# EAGLE design CANBUS_USB (EAGLE 9.6.2)
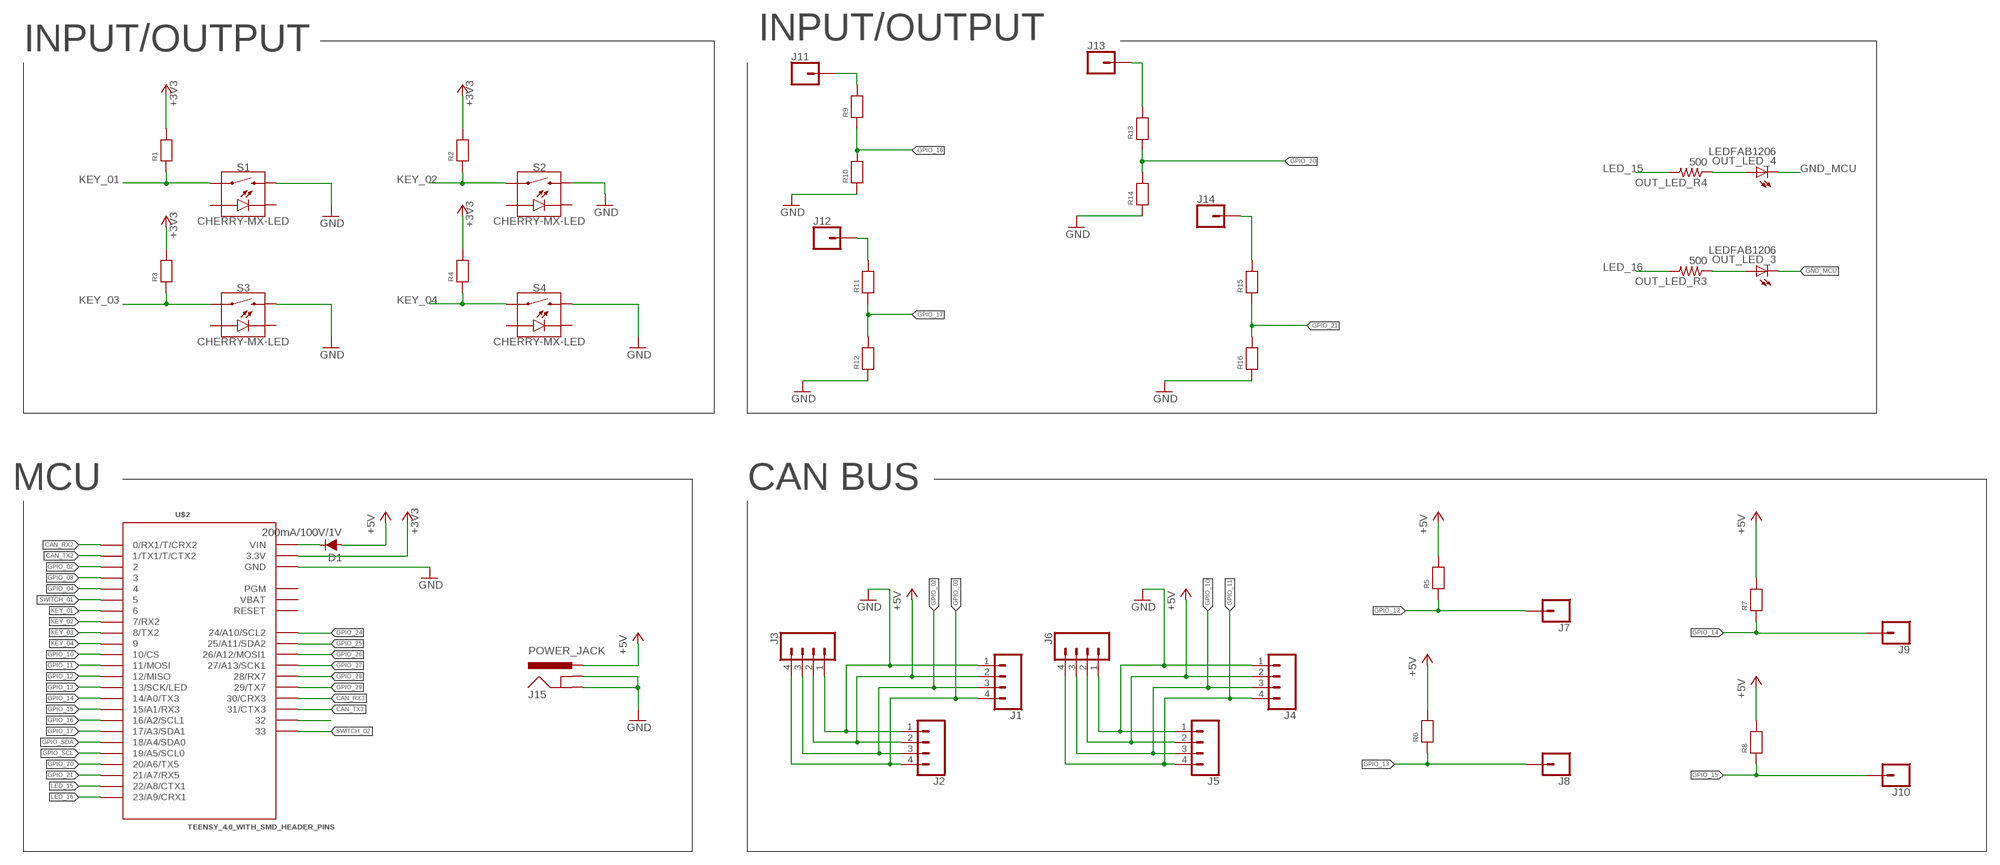
[diagram p0: schematic, sheet 1]

## Parts
D1  200mA/100V/1V  DIODE-1N4148  [DIODE-1N4148]
J1  CONN_04  [1X04]
J2  CONN_04  [1X04]
J3  CONN_04  [1X04]
J4  CONN_04  [1X04]
J5  CONN_04  [1X04]
J6  CONN_04  [1X04]
J7  CONN_01  [1X01]
J8  CONN_01  [1X01]
J9  CONN_01  [1X01]
J10  CONN_01  [1X01]
J11  CONN_01  [1X01]
J12  CONN_01  [1X01]
J13  CONN_01  [1X01]
J14  CONN_01  [1X01]
J15  POWER_JACK  [POWER_JACK_PTH]
OUT_LED_3  LEDFAB1206  [LED1206FAB]
OUT_LED_4  LEDFAB1206  [LED1206FAB]
OUT_LED_R3  500  RES-US1206FAB  [R1206FAB]
OUT_LED_R4  500  RES-US1206FAB  [R1206FAB]
R1  RESISTOR1206  [1206]
R2  RESISTOR1206  [1206]
R3  RESISTOR1206  [1206]
R4  RESISTOR1206  [1206]
R5  RESISTOR1206  [1206]
R6  RESISTOR1206  [1206]
R7  RESISTOR1206  [1206]
R8  RESISTOR1206  [1206]
R9  RESISTOR1206  [1206]
R10  RESISTOR1206  [1206]
R11  RESISTOR1206  [1206]
R12  RESISTOR1206  [1206]
R13  RESISTOR1206  [1206]
R14  RESISTOR1206  [1206]
R15  RESISTOR1206  [1206]
R16  RESISTOR1206  [1206]
S1  CHERRY-MX-LED  [CHERRY-MX-LED]
S2  CHERRY-MX-LED  [CHERRY-MX-LED]
S3  CHERRY-MX-LED  [CHERRY-MX-LED]
S4  CHERRY-MX-LED  [CHERRY-MX-LED]
U$2  TEENSY_4.0_WITH_SMD_HEADER_PINS  [TEENSY_4.0_WITH_SMD_HEADER_PINS]

## Nets
+3V3: R1.2 R2.2 R3.2 R4.2 U$2.3.3V U$2.3.3V1(3.3V)
+5V [vcc5]: D1.A J1.2 J2.2 J3.2 J4.2 J5.2 J6.2 J15.PWR R5.2 R6.2 R7.2 R8.2
CAN_RX2: U$2.0(0/RX1/T/CRX2)
CAN_RX3: U$2.30(30/CRX3)
CAN_TX2: U$2.1(1/TX1/T/CTX2)
CAN_TX3: U$2.31(31/CTX3)
GND: J1.1 J2.1 J3.1 J4.1 J5.1 J6.1 J15.GND J15.GNDBREAK R10.1 R12.1 R14.1 R16.1 S1.S2 S2.S2 S3.S2 S4.S2 U$2.GND U$2.GND1(GND) U$2.GND2(GND)
GND_MCU: OUT_LED_3.2(C) OUT_LED_4.2(C)
GPIO_02: J1.3 J2.3 J3.3 U$2.2
GPIO_03: J1.4 J2.4 J3.4 U$2.3
GPIO_04: U$2.4
GPIO_10: J4.3 J5.3 J6.3 U$2.10(10/CS)
GPIO_11: J4.4 J5.4 J6.4 U$2.11(11/MOSI)
GPIO_12: J7.1 R5.1 U$2.12(12/MISO)
GPIO_13: J8.1 R6.1 U$2.13(13/SCK/LED)
GPIO_14: J9.1 R7.1 U$2.14/A0(14/A0/TX3)
GPIO_15: J10.1 R8.1 U$2.15/A1(15/A1/RX3)
GPIO_16: R9.1 R10.2 U$2.16/A2(16/A2/SCL1)
GPIO_17: R11.1 R12.2 U$2.17/A3(17/A3/SDA1)
GPIO_20: R13.1 R14.2 U$2.20/A6(20/A6/TX5)
GPIO_21: R15.1 R16.2 U$2.21/A7(21/A7/RX5)
GPIO_24: U$2.24(24/A10/SCL2)
GPIO_25: U$2.25(25/A11/SDA2)
GPIO_26: U$2.26(26/A12/MOSI1)
GPIO_27: U$2.27(27/A13/SCK1)
GPIO_28: U$2.28(28/RX7)
GPIO_29: U$2.29(29/TX7)
GPIO_SCL: U$2.19/A5(19/A5/SCL0)
GPIO_SDA: U$2.18/A4(18/A4/SDA0)
KEY_01: R1.1 S1.S1 U$2.6
KEY_02: R2.1 S2.S1 U$2.7(7/RX2)
KEY_03: R3.1 S3.S1 U$2.8(8/TX2)
KEY_04: R4.1 S4.S1 U$2.9
LED_15: OUT_LED_R4.2 U$2.22/A8(22/A8/CTX1)
LED_16: OUT_LED_R3.2 U$2.23/A9(23/A9/CRX1)
N$1: U$2.32
N$2 [vcc5]: J11.1 R9.2
N$3 [vcc5]: J13.1 R13.2
N$4 [vcc5]: J12.1 R11.2
N$5 [vcc5]: J14.1 R15.2
N$6: OUT_LED_3.1(A) OUT_LED_R3.1
N$7: OUT_LED_4.1(A) OUT_LED_R4.1
N$8 [vcc5]: D1.C U$2.VIN
SWITCH_01: U$2.5
SWITCH_02: U$2.33
Unconnected: S1.A S1.K(C) S2.A S2.K(C) S3.A S3.K(C) S4.A S4.K(C) U$2.PGM U$2.RESET

## Notes on the sheet
- INPUT/OUTPUT | INPUT/OUTPUT
- MCU | CAN BUS

## Power pins joined to a net without a drawn wire
VBAT: U$2.VBAT

## Library data of the parts
D1 = SparkFun-DiscreteSemi:DIODE: Diode These are standard reverse protection diodes and small signal diodes. SparkFun Products: SparkFun SparkPunk Sound Kit <https://www.sparkfun.com/products/11177> SparkFun ESP8266 Thing <https://www.sparkfun.com/products/13231>; PROD_ID: DIO-08378
J1-J6 = SparkFun-Connectors:CONN_04: Multi connection point. Often used as Generic Header-pin footprint for 0.1 inch spaced/style header connections On any of the 0.1 inch spaced packages, you can populate with these: Break Away Headers - Straight <https://www.sparkfun.com/products/116> (PRT-00116) Break Away Male Headers - Right Angle <https://www.sparkfun.com/products/553> (PRT-00553) Female Headers <https://www.sparkfun.com/products/115> (PRT-00115) Break Away Headers - Machine Pin <https://www.sparkfun.com/products/117> (PRT-00117) Break Away Female Headers - Swiss Machine Pin <https://www.sparkfun.com/products/743> (PRT-00743) For SCREWTERMINALS and SPRING TERMINALS visit here: Screw Terimnals on SparkFun.com <https://www.sparkfun.com/search/results?term=Screw+Terminals> (5mm/3.5mm/2.54mm spacing) This device is also useful as a general connection point to wire up your design to another part of your project. Our various solder wires solder well into these plated through hole pads. Hook-Up Wire - Assortment (Stranded, 22 AWG) <https://www.sparkfun.com/products/11375> (PRT-11375) Hook-Up Wire - Assortment (Solid Core, 22 AWG) <https://www.sparkfun.com/products/11367> (PRT-11367) View the entire wire category on our website here <https://www.sparkfun.com/categories/141> Special notes: Molex polarized connector foot print use with SKU : PRT-08231 with associated crimp pins and housings. 1MM SMD Version SKU: PRT-10208; PROD_ID: CONN-09696
J7-J14 = SparkFun-Connectors:CONN_01: Single connection point. Often used as Generic Header-pin footprint for 0.1 inch spaced/style header connections On any of the 0.1 inch spaced packages, you can populate with these: Break Away Headers - Straight <https://www.sparkfun.com/products/116> (PRT-00116) Break Away Male Headers - Right Angle <https://www.sparkfun.com/products/553> (PRT-00553) Female Headers <https://www.sparkfun.com/products/115> (PRT-00115) Break Away Headers - Machine Pin <https://www.sparkfun.com/products/117> (PRT-00117) Break Away Female Headers - Swiss Machine Pin <https://www.sparkfun.com/products/743> (PRT-00743) This device is also useful as a general connection point to wire up your design to another part of your project. Our various solder wires solder well into these plated through hole pads. Hook-Up Wire - Assortment (Stranded, 22 AWG) <https://www.sparkfun.com/products/11375> (PRT-11375) Hook-Up Wire - Assortment (Solid Core, 22 AWG) <https://www.sparkfun.com/products/11367> (PRT-11367) View the entire wire category on our website here <https://www.sparkfun.com/categories/141> Special notes: SMTSO-256-ET is a "flush mount" nut for a 4-40 screw. We mostly use this on specialty testbeds; it is a nice way to connect hardware to your PCB at an adjustable hieght. Also note, the SNAP packages are for using a snappable style connector. We sell a baggie of snaps and they are also used on two LilyPad designs: Snap Assortment - 30 pack (male and female) <https://www.sparkfun.com/products/11347> (DEV-11347) LilyPad Arduino SimpleSnap <https://www.sparkfun.com/products/10941> (DEV-10941) LilyPad SimpleSnap Protoboard <https://www.sparkfun.com/products/10940> (DEV-10940)
J15 = SparkFun-Connectors:POWER_JACK: Power Jack Connector This is the standard 5.5mm barrel jack for power. The PTH is the most common, proven, reliable, footprint. The Slot footprint only works if the mill layer is transmitted to the PCB fab house so be warned. Here are the connectors we sell at SparkFun: DC Barrel Power Jack/Connector <https://www.sparkfun.com/products/119> (PRT-00119) DC Barrel Power Jack/Connector (SMD) <https://www.sparkfun.com/products/12748> (PRT-12748) DC Barrel Jack Adapter - Breadboard Compatible <https://www.sparkfun.com/products/10811> (PRT-10811) It is used on this SparkFun product (and many, many others): SparkFun RedBoard - Programmed with Arduino <https://www.sparkfun.com/products/12757> (DEV-12757) Also, if you need a mating power supply or connector, please check these out: Wall Adapter Power Supply - 9VDC 650mA <https://www.sparkfun.com/products/298> (TOL-00298) DC Barrel Jack Adapter - Male <https://www.sparkfun.com/products/10287> (PRT-10287); PROD_ID: CONN-08197
OUT_LED_3 OUT_LED_4 = fab:LED: LED
OUT_LED_R3 OUT_LED_R4 = fab:RES-US: Resistor (US Symbol) Variants with postfix FAB are widened to allow the routing of internal traces
R1-R16 = microbuilder:RESISTOR: Resistors 0402 - 0402 Surface Mount Package 22 Ohm 1% 1/16W [Digikey: 311-22.0LRTR-ND] 33 Ohm 5% 1/16W 1.0K 5% 1/16W 1.5K 5% 1/16W 2.0K 1% 1/16W 10.0K 1% 1/16W [Digikey: 311-10.0KLRTR-ND] 10.0K 5% 1/16W [Digikey: RMCF0402JT10K0TR-ND] 12.1K 1% 1/16W [Digikey: 311-22.0LRTR-ND] 100.0K 5% 1/16W 0603 - 0603 Surface Mount Package 0 Ohm 1/10 Watt 1% Resistor 15 Ohm 1/10 Watt 1% Resistor 33 Ohm 1/10 Watt 1% Resistor 49.9 Ohm 1/10 Watt 1% Resistor 100 Ohm 1/10 Watt 1% Resistor 150 Ohm 1/10 Watt 1% Resistor 240 Ohm 1/10 Watt 1% Resistor 390 Ohm 1/10 Watt 1% Resistor 560 Ohm 1/10 Watt 1% Resistor 680 Ohm 1/10 Watt 1% Resistor 750 Ohm 1/10 Watt 1% Resistor 1.0K Ohm 1/10 Watt 1% Resistor 1.5K Ohm 1/10 Watt 1% Resistor 2.0K Ohm 1/10 Watt 1% Resistor 2.2K Ohm 1/10 Watt 1% Resistor 3.3K Ohm 1/10 Watt 1% Resistor 4.7K Ohm 1/10 Watt 1% Resistor 10.0K Ohm 1/10 Watt 1% Resistor 12.0K Ohm 1/10 Watt 1% Resistor 12.1K Ohm 1/10 Watt 1% Resistor 20.0K Ohm 1/10 Watt 1% Resistor 33.0K Ohm 1/10 Watt 1% Resistor 100.0K Ohm 1/10 Watt 1% Resistor 0805 - 0805 Surface Mount Package 0 Ohm 1/8 Watt 1% Resistor 33 Ohm 1/8 Watt 1% Resistor 100 Ohm 1/8 Watt 1% Resistor 150 Ohm 1/8 Watt 1% Resistor 200 Ohm 1/8 Watt 1% Resistor 240 Ohm 1/8 Watt 1% Resistor 330 Ohm 1/8 Watt 1% Resistor 390 Ohm 1/8 Watt 1% Resistor 470 Ohm 1/8 Watt 1% Resistor 1.0K Ohm 1/8 Watt 1% Resistor 1.5K Ohm 1/8 Watt 1% Resistor 2.0K Ohm 1/8 Watt 1% Resistor 4.7K Ohm 1/8 Watt 1% Resistor 5.1K Ohm 1/8 Watt 1% Resistor 5.6K Ohm 1/8 Watt 1% Resistor 10.0K Ohm 1/8 Watt 1% Resistor 22.0K Ohm 1/8 Watt 1% Resistor 33.0K Ohm 1/8 Watt 1% Resistor 100K Ohm 1/8 Watt 1% Resistor 1206 - 1206 Surface Mount Package 2012 - 2010 Surface Mount Package 0.11 Ohm 1/2 Watt 1% Resistor - Digikey: RHM.11UCT-ND
S1-S4 = cherry-temp:CHERRY-MX-LED
U$2 = Teensy4:TEENSY_4.0_WITH_SMD_HEADER_PINS: Footprint for Teensy 3.1 or 3.2 board using all pin connections on the outer perimeter

## Net classes
0 default: width 0.2 mm, clearance 0.2 mm
1 gnd: width 0.2 mm, clearance 0.2 mm
3 vcc: width 1.1 mm, clearance 0.2 mm
4 vcc5: width 1.1 mm, clearance 0.2 mm

## Board
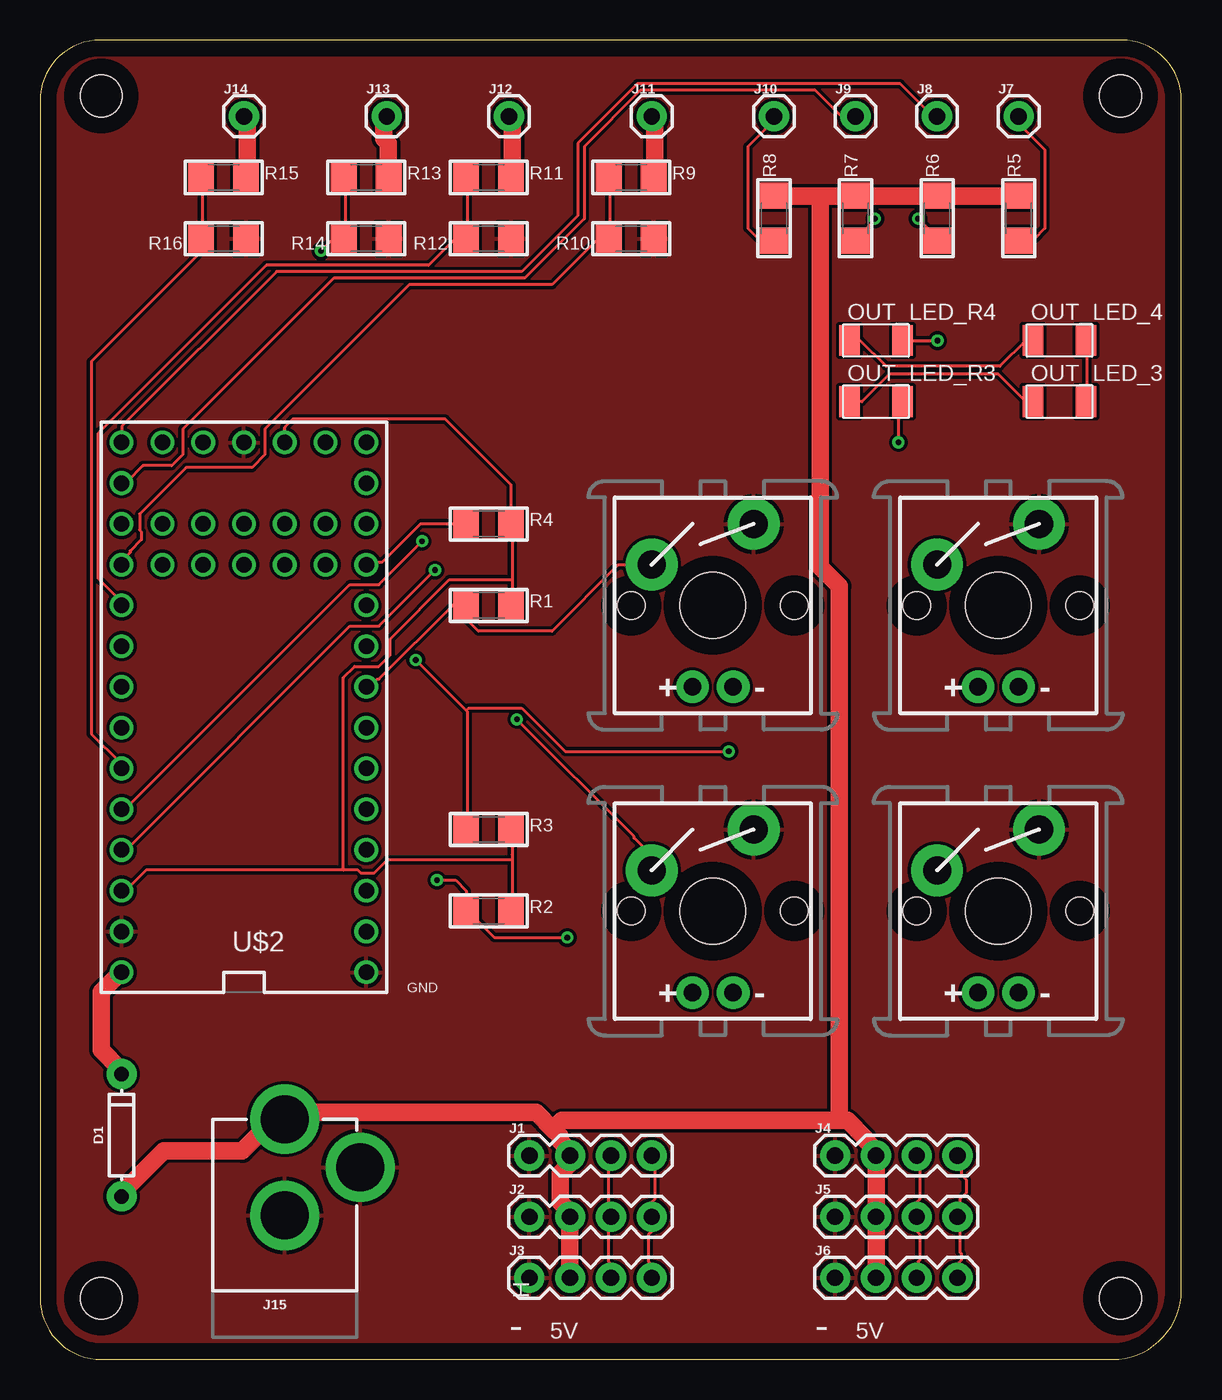
[diagram p1: board, top side]
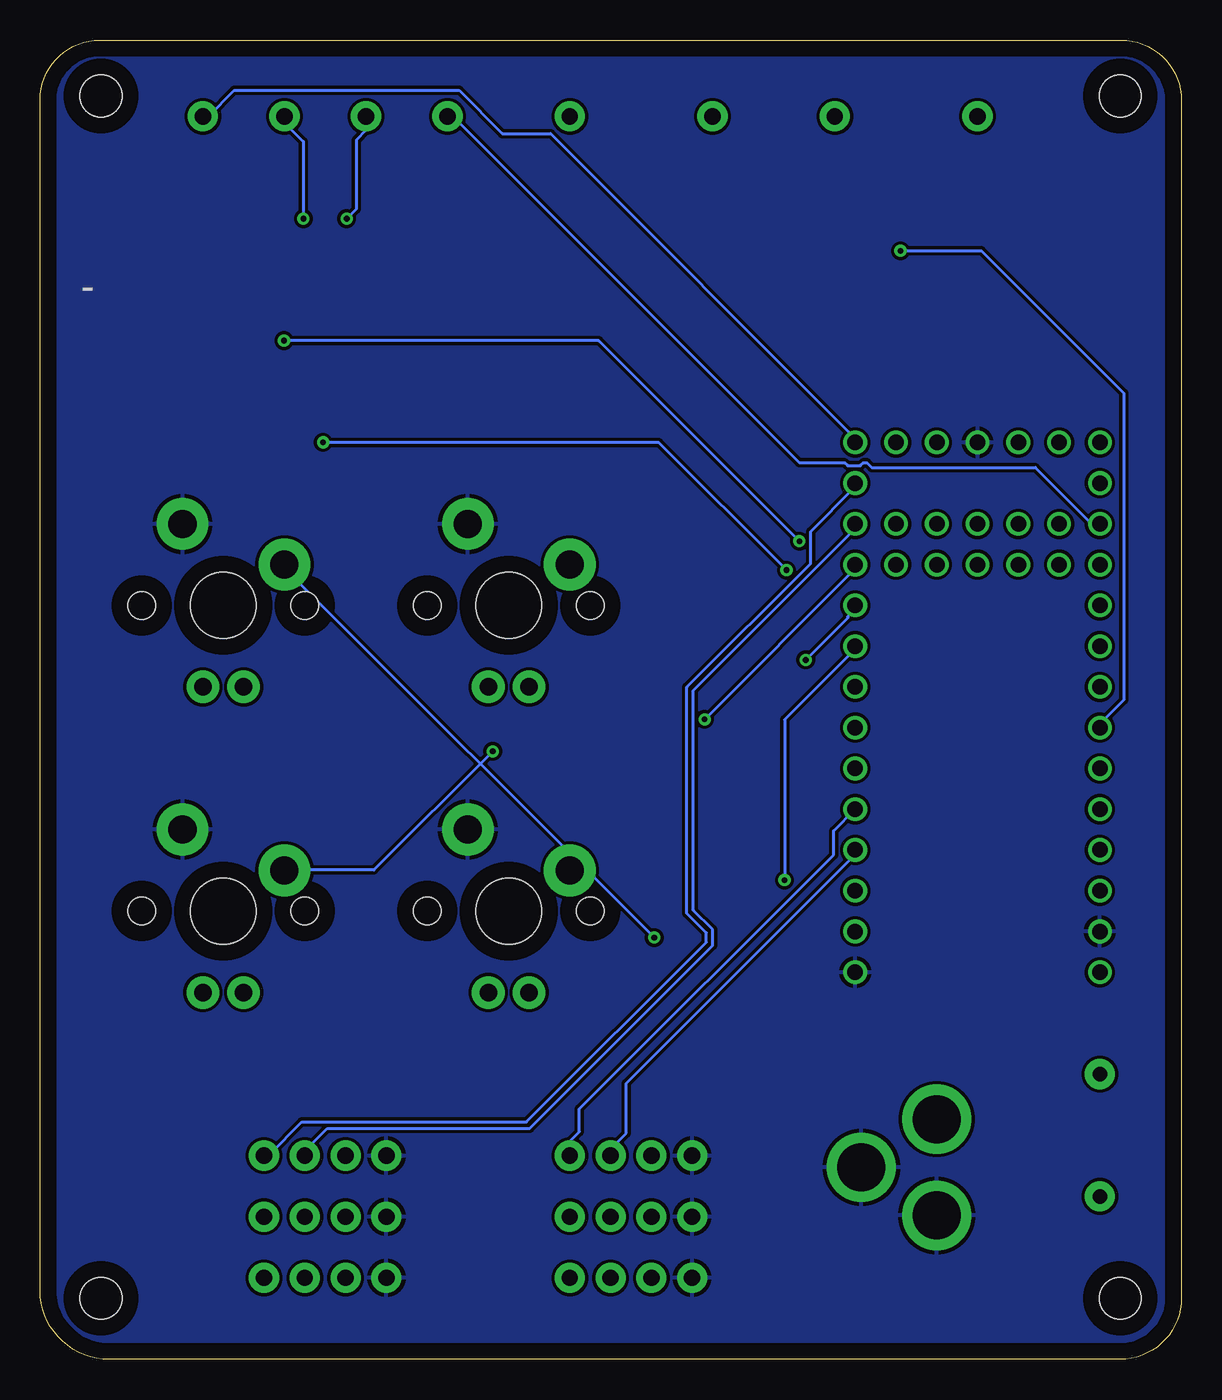
[diagram p2: board, bottom side, seen from below]

Size 71.1 x 82.22 mm. Coordinates in mm from the lower left corner, seen from the top.
Outline: 0,78.47 0,3.81 arc90 3.81,0 66.8,0 arc90 71.1,4.3 71.1,78.5 arc90 67.38,82.22 3.75,82.22 arc90 0,78.47
Copper layers (1*16): Top 0.035mm / dielectric 1.5mm / Bottom 0.035mm
Design rules "default": minimum track width 6mil, minimum drill 0.35mm, track to track 6mil, track to pad 6mil, pad to pad 6mil, via to via 6mil, smd to smd 6mil, copper to edge 40mil, drill to drill 6mil, minimum pad ring 10mil, minimum via ring 8mil, stop-mask expansion 4mil, vias tented up to drill 0mil, thermal gap 10mil
Holes 2.6 mm at 3.81,78.74 67.31,78.74 3.81,3.81 67.31,3.81

### Footprints (pad centres in the part's own frame; a part is rotated, then mirrored left to right if it is on the bottom)
DIODE-1N4148 = drill 0.9 pad 1.88: A -3.81,0; C 3.81,0
1X04 = drill 1.016 pad 1.88: 1 0,0; 2 2.54,0; 3 5.08,0; 4 7.62,0
1X01 = drill 1.016 pad 1.88: 1 0,0
POWER_JACK_PTH = drill 2.997 pad 4.318: GND 0,7.7; GNDBREAK 4.7,10.7; PWR 0,13.7
LED1206FAB = smd 1.27 x 1.905: 1 -1.651,0; 2 1.651,0
R1206FAB = smd 1.27 x 1.905: 1 -1.651,0; 2 1.651,0
1206 = smd 1.6 x 1.8: 1 -1.4,0; 2 1.4,0
CHERRY-MX-LED = drill 1.092 pad 2.032: A -1.27,-5.08; K 1.27,-5.08 | drill 1.753 pad 3.226: S1 -3.81,2.54; S2 2.54,5.08 | hole 4.089: 0,0 | hole 1.707: -5.08,0; 5.08,0
TEENSY_4.0_WITH_SMD_HEADER_PINS = drill 0.965: 0 -7.62,13.97; 1 -7.62,11.43; 2 -7.62,8.89; 3 -7.62,6.35; 3.3V 7.62,11.43; 3.3V1 -2.54,-16.51; 4 -7.62,3.81; 5 -7.62,1.27; 6 -7.62,-1.27; 7 -7.62,-3.81; 8 -7.62,-6.35; 9 -7.62,-8.89; 10 -7.62,-11.43; 11 -7.62,-13.97; 12 -7.62,-16.51; 13 7.62,-16.51; 14/A0 7.62,-13.97; 15/A1 7.62,-11.43; 16/A2 7.62,-8.89; 17/A3 7.62,-6.35; 18/A4 7.62,-3.81; 19/A5 7.62,-1.27; 20/A6 7.62,1.27; 21/A7 7.62,3.81; 22/A8 7.62,6.35; 23/A9 7.62,8.89; 24 5.08,-11.43; 25 5.08,-8.89; 26 2.54,-11.43; 27 2.54,-8.89; 28 0,-11.43; 29 0,-8.89; 30 -2.54,-11.43; 31 -2.54,-8.89; 32 -5.08,-11.43; 33 -5.08,-8.89; GND -7.62,16.51; GND1 0,-16.51; GND2 7.62,13.97; PGM 2.54,-16.51; RESET 5.08,-16.51; VBAT -5.08,-16.51; VIN 7.62,16.51

### Placement (x,y rotation side)
D1  5.08,13.97 90 top
J1  30.48,12.7 0 top
J2  30.48,8.89 0 top
J3  30.48,5.08 0 top
J4  49.53,12.7 0 top
J5  49.53,8.89 0 top
J6  49.53,5.08 0 top
J7  60.96,77.47 0 top
J8  55.88,77.47 0 top
J9  50.8,77.47 0 top
J10  45.72,77.47 0 top
J11  38.1,77.47 0 top
J12  29.21,77.47 0 top
J13  21.59,77.47 0 top
J14  12.7,77.47 0 top
J15  15.24,1.27 0 top
OUT_LED_3  63.5,59.69 0 top
OUT_LED_4  63.5,63.5 0 top
OUT_LED_R3  52.07,59.69 0 top
OUT_LED_R4  52.07,63.5 0 top
R1  27.94,46.99 0 top
R2  27.94,27.94 0 top
R3  27.94,33.02 0 top
R4  27.94,52.07 0 top
R5  60.96,71.12 90 top
R6  55.88,71.12 90 top
R7  50.8,71.12 90 top
R8  45.72,71.12 90 top
R9  36.83,73.66 0 top
R10  36.83,69.85 180 top
R11  27.94,73.66 0 top
R12  27.94,69.85 180 top
R13  20.32,73.66 0 top
R14  20.32,69.85 180 top
R15  11.43,73.66 0 top
R16  11.43,69.85 180 top
S1  41.91,46.99 0 top
S2  59.69,46.99 0 top
S3  59.69,27.94 0 top
S4  41.91,27.94 0 top
U$2  12.7,40.64 180 top

### Tracks (layer width: path | path; a pad name or v marks a point on that pad's centre or on a via)
+3V3
  Top 0.2: 29.4,48.59 29.4,51.99 R4.2 29.34,54.49 25.24,58.59 15.73,58.59 15.24,58.1 U$2.3.3V1 | 29.4,48.59 29.4,46.99 R1.2 | 29.4,31.46 29.4,27.99 R2.2 | R3.2 29.4,32.96 29.4,31.12 21.64,31.12 20.8,30.29 20,30.29 19.8,30.49 18.9,30.49 | 18.9,30.49 6.6,30.49 5.4,29.29 5.1,29.29 U$2.3.3V | 29.4,48.59 25.5,48.59 21.8,44.89 21.8,43.89 21.1,43.19 19.6,43.19 18.9,42.49 18.9,30.49
+5V
  Top 1.1: 48.6,72.49 50.8,72.49 R7.2 51.3,72.49 55.8,72.49 R6.2 56.4,72.49 60.9,72.49 R5.2 | 48.6,72.49 45.8,72.49 R8.2 | J6.2 52.1,5.09 52.1,8.89 J5.2 52.1,8.96 52.1,12.69 J4.2 51.9,13.19 51.4,13.69 51.4,13.79 50.3,14.89 49.8,14.89 | J3.2 33,5.09 33,8.89 J2.2 32.8,9.39 32.4,9.79 32.4,11.59 33,12.19 33,12.69 J1.2 32.8,13.19 32.4,13.59 32.4,13.89 31.95,14.34 | D1.A 5.1,10.19 5.1,10.39 7.7,12.99 12.6,12.99 14.5,14.89 15.2,14.89 J15.PWR 15.8,14.99 16.8,14.99 17.2,15.39 30.9,15.39 31.95,14.34 | 49.8,14.89 32.5,14.89 31.95,14.34 | 48.6,72.49 48.6,49.39 49.8,48.19 49.8,14.89
GND
  pour Bottom (isolate 0.2): -43.92,90.17 132.61,90.17 132.61,-86.36 arc-90
  pour Top: -58.42,86.36 119.38,86.36 119.38,0 -58.42,0
GND_MCU
  Top 0.2: OUT_LED_3.2 65.2,59.69 65.2,63.49 OUT_LED_4.2
GPIO_02
  Top 0.2: J3.3 35.5,5.09 35.5,5.99 35.4,6.09 35.4,8.79 35.5,8.89 J2.3 35.4,8.89 35.4,12.59 35.5,12.69 J1.3
  Bottom 0.2: U$2.2 20.4,31.69 20.4,31.39 34.6,17.19 34.6,14.09 35.5,13.19 35.5,12.79 J1.3
GPIO_03
  Top 0.2: J3.4 38.1,5.89 37.9,6.09 37.9,7.79 38.1,7.99 J2.4 38.1,9.79 38.3,9.99 38.3,12.49 J1.4
  Bottom 0.2: U$2.3 21.67,32.94 21.67,31.45 37.5,15.62 37.5,14.19 38.1,13.59 J1.4
GPIO_10
  Top 0.2: J5.3 54.6,7.99 54.8,7.79 54.8,6.19 54.7,6.09 54.7,5.09 J6.3 | J5.3 54.6,9.79 54.8,9.99 54.8,12.59 54.7,12.69 J4.3 | J5.3
  Bottom 0.2: U$2.10 20.4,51.99 20.4,51.69 30.4,41.69 30.4,27.99 29.2,26.79 29.2,25.79 40.6,14.39 53.2,14.39 54.6,12.99 54.6,12.79 J4.3
GPIO_11
  Top 0.2: J6.4 57.2,5.09 57.2,5.99 57.4,6.19 57.4,6.59 57.3,6.69 57.3,8.79 57.2,8.89 J5.4 57.3,8.89 57.3,9.99 57.7,10.39 57.7,11.19 57.4,11.49 57.4,11.79 57.2,11.99 57.2,12.69 J4.4
  Bottom 0.2: U$2.11 20.4,54.59 20.4,54.29 23.1,51.59 23.1,49.59 30.8,41.89 30.8,27.79 29.6,26.59 29.6,25.99 40.8,14.79 54.8,14.79 56.8,12.79 57.1,12.79 J4.4
GPIO_12
  Top 0.2: R5.1 61,69.79 61.9,69.79 62.6,70.49 62.6,75.39 61,76.99 61,77.39 J7.1
  Bottom 0.2: U$2.12 20.4,57.19 20.4,57.49 39.3,76.39 42.3,76.39 45,79.09 59,79.09 60.6,77.49 60.9,77.49 J7.1
GPIO_13  (via drill 0.35)
  Top 0.2: v54.7,71.09 55.8,69.99 55.8,69.79 R6.1 | U$2.13 5.1,57.19 5.1,58.15 14.74,67.79 30,67.79 33.5,71.29 33.5,75.79 37.2,79.49 53.6,79.49 55.6,77.49 55.8,77.49 J8.1
  Bottom 0.2: v54.7,71.09 54.7,75.89 55.8,76.99 55.8,77.39 J8.1
GPIO_14  (via drill 0.35)
  Top 0.2: v52,71.09 52,70.99 50.8,69.79 R7.1 | U$2.14/A0 5.1,54.69 5.4,54.69 6.4,55.69 8.2,55.69 8.9,56.39 8.9,57.99 18.3,67.39 30.2,67.39 33.9,71.09 33.9,75.59 37.4,79.09 48.3,79.09 49.9,77.49 50.8,77.49 J9.1
  Bottom 0.2: v52,71.09 51.4,71.69 51.4,75.99 50.8,76.59 J9.1
GPIO_15
  Top 0.2: R8.1 45.7,69.79 44.8,69.79 44.1,70.49 44.1,75.59 45.7,77.19 45.7,77.39 J10.1
  Bottom 0.2: U$2.15/A1 5.1,52.09 5.6,52.09 9.1,55.59 19.3,55.59 19.6,55.89 19.8,55.89 20,55.69 20.8,55.69 21,55.89 23.8,55.89 45.3,77.39 45.7,77.39 J10.1
GPIO_16
  Top 0.2: R9.1 35.5,73.59 35.5,69.89 R10.2 35.4,69.79 34.7,69.79 31.9,66.99 23,66.99 14,57.99 14,56.39 13.2,55.59 9.1,55.59 6.2,52.69 6.2,51.69 6.3,51.59 6.3,51.09 5.6,50.39 5.6,50.29 5.1,49.79 5.1,49.59 U$2.16/A2
GPIO_17
  Top 0.2: R11.1 26.6,73.59 26.6,69.89 R12.2 26.5,69.79 25.8,69.79 24.2,68.19 14.1,68.19 3.6,57.69 3.6,48.69 5,47.29 5,46.99 U$2.17/A3
GPIO_20  (via drill 0.35)
  Top 0.2: R13.1 19,73.59 19,69.89 R14.2 18.9,69.79 18.2,69.79 v17.5,69.09
  Bottom 0.2: v17.5,69.09 12.46,69.09 3.6,60.23 3.6,41.09 5,39.69 5,39.39 U$2.20/A6
GPIO_21
  Top 0.2: R15.1 10.1,73.59 10.1,69.89 R16.2 10,69.79 10,68.99 3.2,62.19 3.2,38.99 5,37.19 5,36.89 U$2.21/A7
KEY_01
  Top 0.2: U$2.6 20.4,41.99 20.6,41.99 21,42.39 21.1,42.39 25.7,46.99 R1.1 26.6,46.99 26.6,46.09 27.3,45.39 31.9,45.39 36,49.49 38.1,49.49 S1.S1
KEY_02  (via drill 0.35)
  Top 0.2: v24.72,29.87 25.88,29.87 26.54,29.21 R2.1 26.6,27.99 28.3,26.29 v32.84,26.29
  Bottom 0.2: v24.72,29.87 24.72,39.87 20.4,44.19 20.4,44.39 U$2.7 | S2.S1 55.88,49.33 v32.84,26.29
KEY_03  (via drill 0.35)
  Top 0.2: v23.4,43.59 26.55,40.44 | 26.55,40.44 26.6,40.39 26.6,33.06 R3.1 | v42.9,37.89 32.7,37.89 30,40.59 26.7,40.59 26.55,40.44
  Bottom 0.2: v23.4,43.59 20.8,46.19 20.8,46.29 20.4,46.69 20.4,46.99 U$2.8 | v42.9,37.89 50.3,30.49 55.8,30.49 S3.S1
KEY_04  (via drill 0.35)
  Top 0.2: R4.1 26.5,52.09 23.7,52.09 21.3,49.69 20.5,49.69 20.4,49.59 U$2.9 | v29.7,39.89 37,32.59 37,32.49 38.1,31.39 S4.S1
  Bottom 0.2: v29.7,39.89 20.4,49.19 20.4,49.49 U$2.9
LED_15  (via drill 0.35)
  Top 0.2: OUT_LED_R4.2 v55.9,63.5 v55.91,63.49 | v23.8,50.99 21.1,48.29 19.3,48.29 5.3,34.29 U$2.22/A8
  Bottom 0.2: v55.91,63.49 36.3,63.49 v23.8,50.99
LED_16  (via drill 0.35)
  Top 0.2: OUT_LED_R3.2 53.47,59.44 v53.47,57.15 | v24.6,49.19 21.1,45.69 19.3,45.69 5.4,31.79 5.1,31.79 U$2.23/A9
  Bottom 0.2: v53.47,57.15 32.56,57.15 v24.6,49.19
N$2
  Top 1.1: J11.1 38.1,77.19 38.3,76.99 38.3,73.69 R9.2
N$3
  Top 1.1: R13.2 21.7,73.69 21.7,75.79 21.4,76.09 21.4,76.99 21.5,77.09 21.5,77.39 J13.1
N$4
  Top 1.1: R11.2 29.4,73.69 29.4,76.99 29.3,77.09 29.3,77.39 J12.1
N$5
  Top 1.1: J14.1 12.7,77.19 12.9,76.99 12.9,73.69 R15.2
N$6
  Top 0.2: OUT_LED_R3.1 51.2,59.69 52.9,61.39 59.7,61.39 61.4,59.69 OUT_LED_3.1
N$7
  Top 0.2: OUT_LED_R4.1 50.5,63.49 51.1,63.49 52.7,61.89 59.8,61.89 61.4,63.49 61.8,63.49 OUT_LED_4.1
N$8
  Top 1.1: U$2.VIN 5,24.09 3.8,22.89 3.8,19.29 5,18.09 5,17.79 D1.C

### Text on the board
tPlace: GND | H | - | 5V | - | 5V
bPlace: -